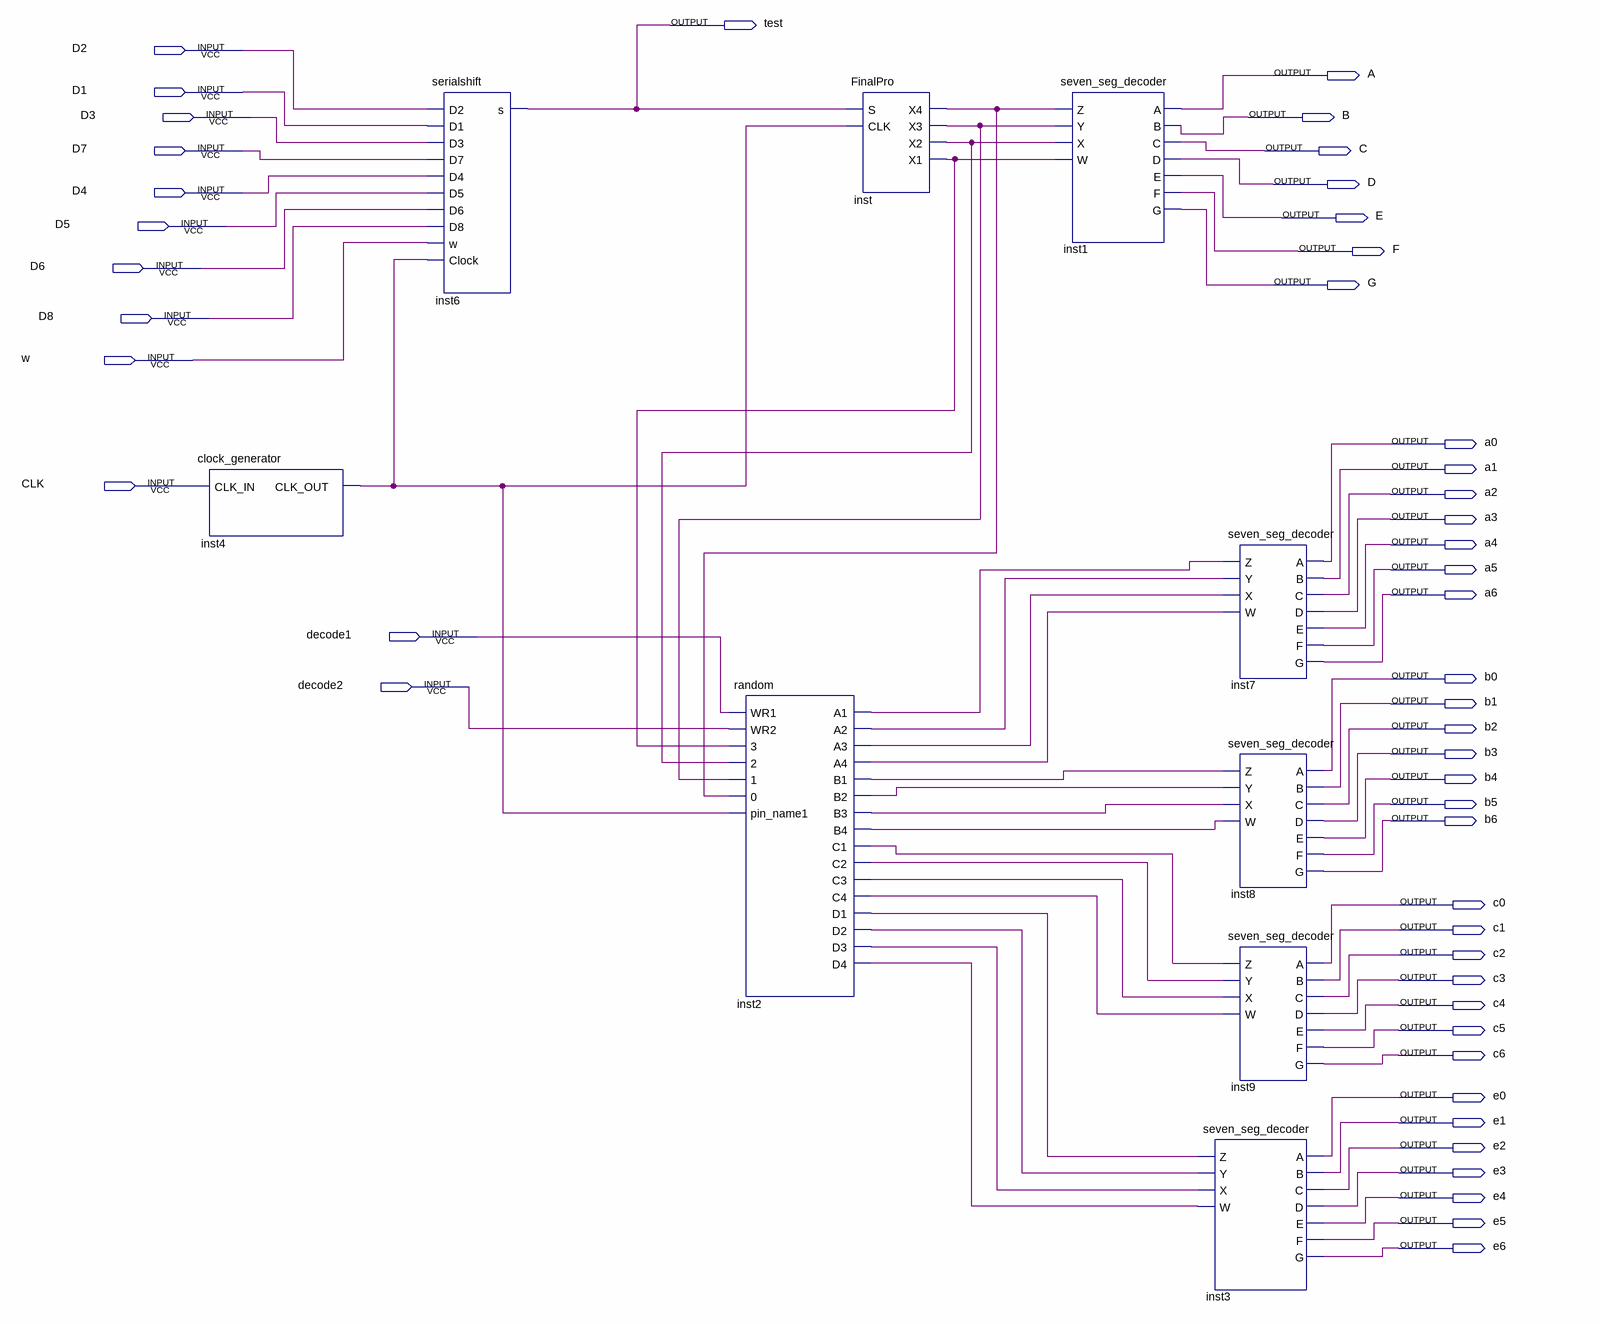
[diagram p0: schematic sheet]
// Quartus schematic FinalProject.bdf as structural Verilog: 9 symbols, 48 pins
module FinalProject (
  input  D2,
  input  D1,
  input  D3,
  input  D7,
  input  D4,
  input  D5,
  input  D6,
  input  D8,
  input  w,
  input  CLK,
  input  decode1,
  input  decode2,
  output test,
  output A,
  output B,
  output C,
  output D,
  output E,
  output F,
  output G,
  output a0,
  output a1,
  output a2,
  output a3,
  output a4,
  output a5,
  output a6,
  output b0,
  output b1,
  output b2,
  output b3,
  output b4,
  output b5,
  output b6,
  output c0,
  output c1,
  output c2,
  output c3,
  output c4,
  output c5,
  output c6,
  output e0,
  output e1,
  output e2,
  output e3,
  output e4,
  output e5,
  output e6
);

  wire inst2_a1, inst2_a2, inst2_a3, inst2_a4, inst2_b1, inst2_b2, inst2_b3, inst2_b4, inst2_c1, inst2_c2,
       inst2_c3, inst2_c4, inst2_d1, inst2_d2, inst2_d3, inst2_d4, inst4_clk_out, inst_x1, inst_x2, inst_x3,
       inst_x4;

  clock_generator inst4 (.CLK_IN(CLK), .CLK_OUT(inst4_clk_out));
  serialshift inst6 (
    .D2(D2), .D1(D1), .D3(D3), .D7(D7), .D4(D4), .D5(D5), .D6(D6), .D8(D8), .w(w), .Clock(inst4_clk_out),
    .s(test));
  random inst2 (
    .WR1(decode1), .WR2(decode2), .\3 (inst_x1), .\2 (inst_x2), .\1 (inst_x3), .\0 (inst_x4),
    .pin_name1(inst4_clk_out), .A1(inst2_a1), .A2(inst2_a2), .A3(inst2_a3), .A4(inst2_a4), .B1(inst2_b1),
    .B2(inst2_b2), .B3(inst2_b3), .B4(inst2_b4), .C1(inst2_c1), .C2(inst2_c2), .C3(inst2_c3), .C4(inst2_c4),
    .D1(inst2_d1), .D2(inst2_d2), .D3(inst2_d3), .D4(inst2_d4));
  FinalPro inst (.S(test), .CLK(inst4_clk_out), .X4(inst_x4), .X3(inst_x3), .X2(inst_x2), .X1(inst_x1));
  seven_seg_decoder inst1 (
    .Z(inst_x4), .Y(inst_x3), .X(inst_x2), .W(inst_x1), .A(A), .B(B), .C(C), .D(D), .E(E), .F(F), .G(G));
  seven_seg_decoder inst7 (
    .Z(inst2_a1), .Y(inst2_a2), .X(inst2_a3), .W(inst2_a4), .A(a0), .B(a1), .C(a2), .D(a3), .E(a4), .F(a5),
    .G(a6));
  seven_seg_decoder inst8 (
    .Z(inst2_b1), .Y(inst2_b2), .X(inst2_b3), .W(inst2_b4), .A(b0), .B(b1), .C(b2), .D(b3), .E(b4), .F(b5),
    .G(b6));
  seven_seg_decoder inst9 (
    .Z(inst2_c1), .Y(inst2_c2), .X(inst2_c3), .W(inst2_c4), .A(c0), .B(c1), .C(c2), .D(c3), .E(c4), .F(c5),
    .G(c6));
  seven_seg_decoder inst3 (
    .Z(inst2_d1), .Y(inst2_d2), .X(inst2_d3), .W(inst2_d4), .A(e0), .B(e1), .C(e2), .D(e3), .E(e4), .F(e5),
    .G(e6));
endmodule
